# EAGLE design main (EAGLE 6.5.0)
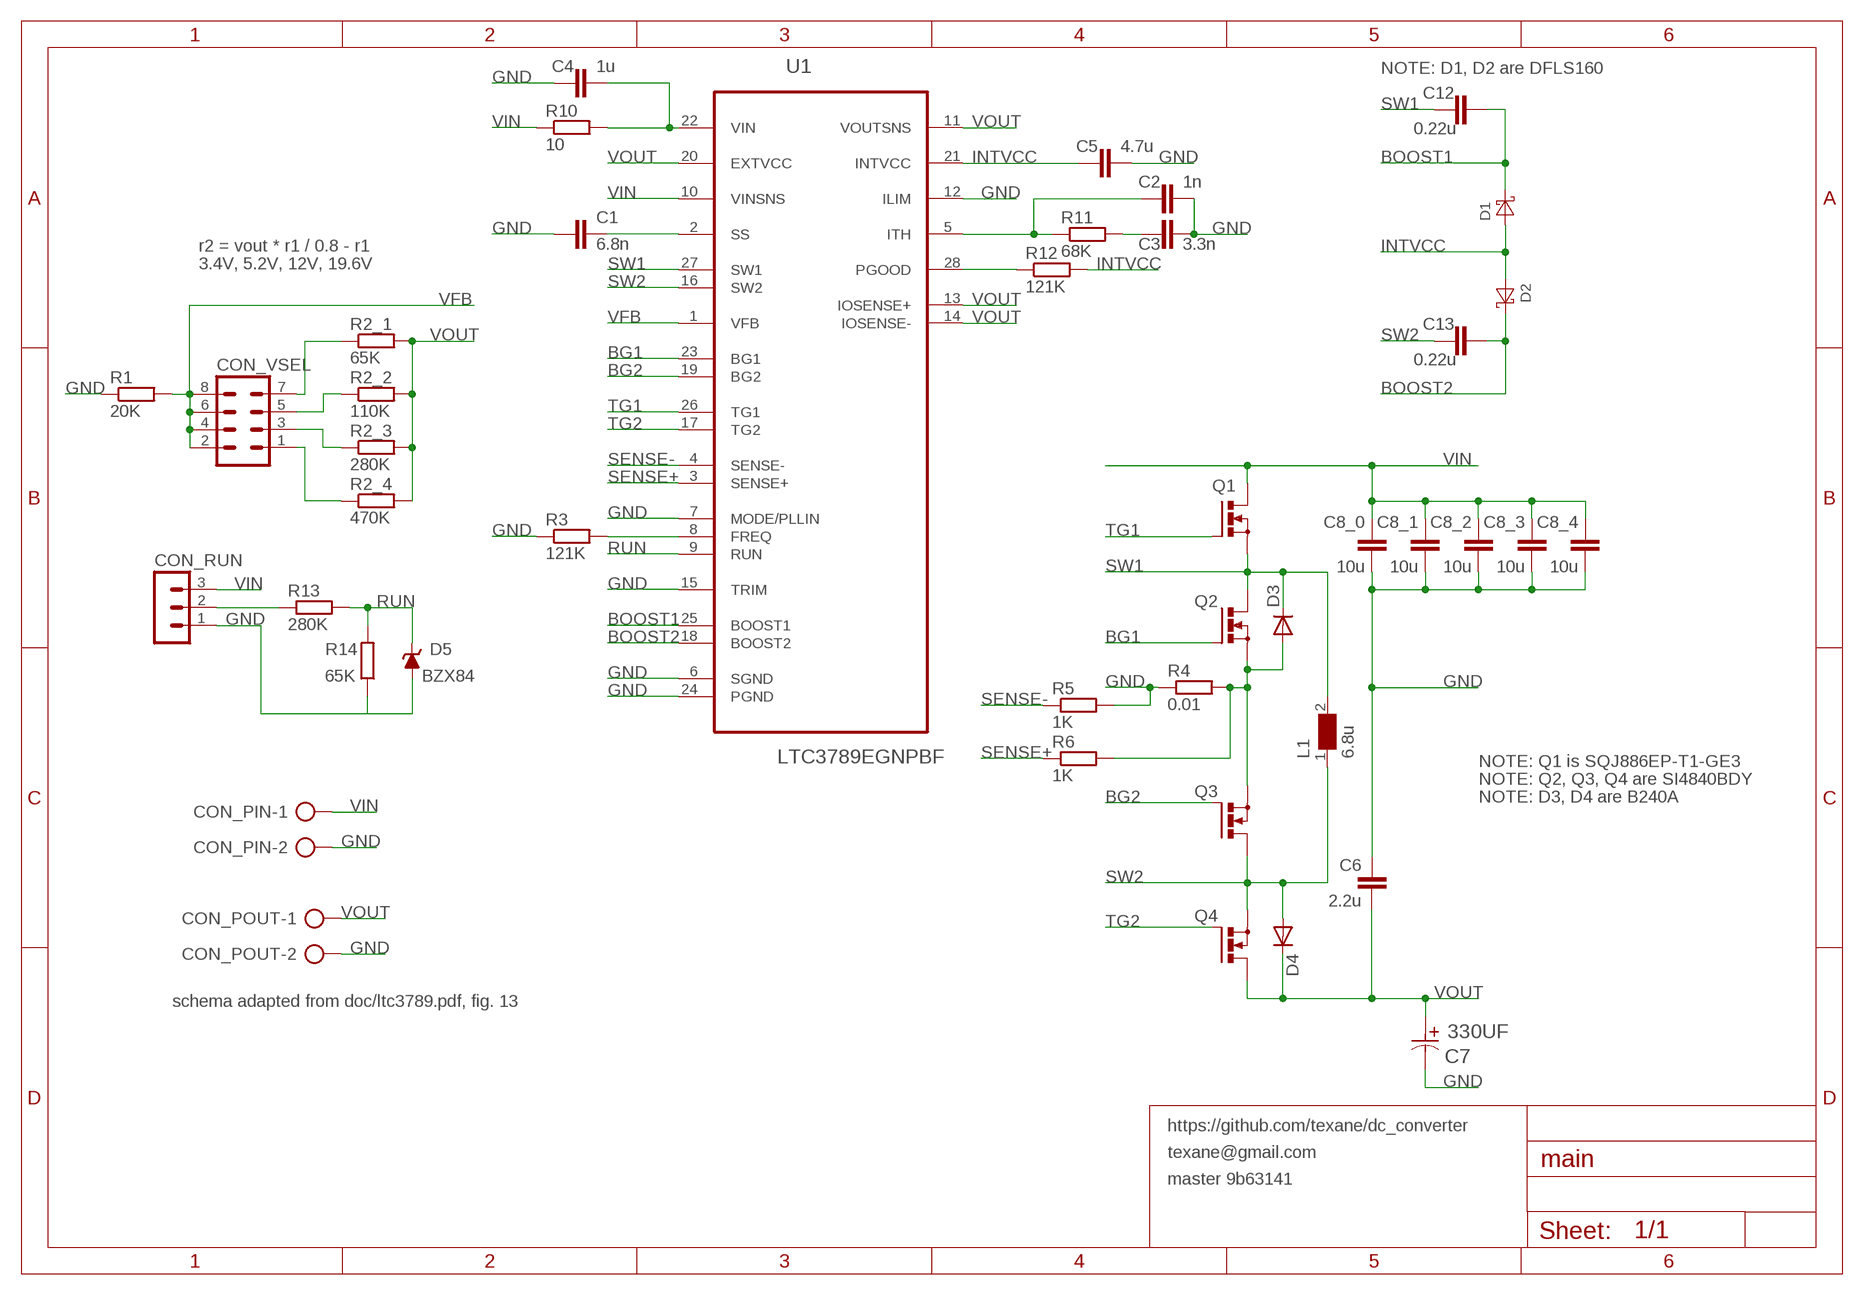
[diagram p0: schematic, sheet 1]

## Parts
C1  6.8n  C-EUC1206K  [C1206K]
C2  1n  C-EUC1206K  [C1206K]
C3  3.3n  C-EUC1206K  [C1206K]
C4  1u  C-EUC1206K  [C1206K]
C5  4.7u  C-EUC1206K  [C1206K]
C6  2.2u  C-EUC1206K  [C1206K]
C7  330UF  EEE-FT1H331AP-CASE-G  [CAPAE1030X1050N]
C8_0  10u  C-EUC1206K  [C1206K]
C8_1  10u  C-EUC1206K  [C1206K]
C8_2  10u  C-EUC1206K  [C1206K]
C8_3  10u  C-EUC1206K  [C1206K]
C8_4  10u  C-EUC1206K  [C1206K]
C12  0.22u  C-EUC1206K  [C1206K]
C13  0.22u  C-EUC1206K  [C1206K]
CON_PIN  AK300/2  [AK300/2]
CON_POUT  AK300/2  [AK300/2]
CON_RUN  MA03-1  [MA03-1]
CON_VSEL  MA04-2  [MA04-2]
D1  DIODE-SCHOTTKY-POWER-DI-123  [POWER-DI-123]
D2  DIODE-SCHOTTKY-POWER-DI-123  [POWER-DI-123]
D3  DIODE-DO214AC  [DO214AC]
D4  DIODE-DO214AC  [DO214AC]
D5  BZX84  [SOT23]
L1  6.8u  WE-HCC-7443320680_1210  [WE-HCC_1210]
Q1  SQJ886EP  [POWERPAK-SO-08L]
Q2  N-MOSFET-SO8S  [SO-08]
Q3  N-MOSFET-SO8S  [SO-08]
Q4  N-MOSFET-SO8S  [SO-08]
R1  20K  R-EU_R1206  [R1206]
R2_1  65K  R-EU_R1206  [R1206]
R2_2  110K  R-EU_R1206  [R1206]
R2_3  280K  R-EU_R1206  [R1206]
R2_4  470K  R-EU_R1206  [R1206]
R3  121K  R-EU_R1206  [R1206]
R4  0.01  R-EU_R1206  [R1206]
R5  1K  R-EU_R1206  [R1206]
R6  1K  R-EU_R1206  [R1206]
R10  10  R-EU_R1206  [R1206]
R11  68K  R-EU_R1206  [R1206]
R12  121K  R-EU_R1206  [R1206]
R13  280K  R-EU_R1206  [R1206]
R14  65K  R-EU_R1206  [R1206]
U1  LTC3789EGNPBF  [SOP65P640X120-28N]

## Nets
BG1: Q2.4(G) U1.23(BG1)
BG2: Q3.4(G) U1.19(BG2)
BOOST1: C12.2 D1.C U1.25(BOOST1)
BOOST2: C13.2 D2.C U1.18(BOOST2)
GND: C1.1 C2.2 C3.2 C4.1 C5.2 C6.2 C7.2 C8_0.2 C8_1.2 C8_2.2 C8_3.2 C8_4.2 CON_PIN.2 CON_POUT.2 CON_RUN.1 D5.1(A) R1.1 R3.1 R4.1 R5.2 R14.1 U1.6(SGND) U1.7(MODE/PLLIN) U1.12(ILIM) U1.15(TRIM) U1.24(PGND)
INTVCC: C5.1 D1.A D2.A R12.2 U1.21(INTVCC)
N$1: R3.2 U1.8(FREQ)
N$2: C4.2 R10.2 U1.22(VIN)
N$3: C1.2 U1.2(SS)
N$4: C2.1 R11.1 U1.5(ITH)
N$5: C3.1 R11.2
N$6: R12.1 U1.28(PGOOD)
N$7: CON_VSEL.5 R2_2.1
N$8: CON_VSEL.7 R2_1.1
N$9: D3.A Q2.1(S) Q2.2(S) Q2.3(S) Q3.1(S) Q3.2(S) Q3.3(S) R4.2 R6.2
N$10: CON_VSEL.3 R2_3.1
N$11: CON_RUN.2 R13.1
RUN: D5.3(C) R13.2 R14.2 U1.9(RUN)
SENSE+: R6.1 U1.3(SENSE+)
SENSE-: R5.1 U1.4(SENSE-)
SW1: C12.1 D3.C L1.2 Q1.1(S) Q1.2(S) Q1.3(S) Q2.5(D) Q2.6(D) Q2.7(D) Q2.8(D) U1.27(SW1)
SW2: C13.1 D4.A L1.1 Q3.5(D) Q3.6(D) Q3.7(D) Q3.8(D) Q4.1(S) Q4.2(S) Q4.3(S) U1.16(SW2)
TG1: Q1.4(G) U1.26(TG1)
TG2: Q4.4(G) U1.17(TG2)
VFB: CON_VSEL.1 CON_VSEL.2 CON_VSEL.4 CON_VSEL.6 CON_VSEL.8 R1.2 R2_4.1 U1.1(VFB)
VIN: C8_0.1 C8_1.1 C8_2.1 C8_3.1 C8_4.1 CON_PIN.1 CON_RUN.3 Q1.5-8(D) R10.1 U1.10(VINSNS)
VOUT: C6.1 C7.1 CON_POUT.1 D4.C Q4.5(D) Q4.6(D) Q4.7(D) Q4.8(D) R2_1.2 R2_2.2 R2_3.2 R2_4.2 U1.11(VOUTSNS) U1.13(IOSENSE+) U1.14(IOSENSE-) U1.20(EXTVCC)

## Notes on the sheet
- NOTE: D1, D2 are DFLS160
- r2 = vout * r1 / 0.8 - r1
- 3.4V, 5.2V, 12V, 19.6V
- NOTE: Q1 is SQJ886EP-T1-GE3
- NOTE: Q2, Q3, Q4 are SI4840BDY
- NOTE: D3, D4 are B240A
- schema adapted from doc/ltc3789.pdf, fig. 13
- https://github.com/texane/dc_converter
- texane@gmail.com
- master 9b63141

## Library data of the parts
C1-C6 C8_0 C8_1-C8_4 C12 C13 = rcl:C-EU: CAPACITOR, European symbol
C7 = Panasonic-EEEFT_EEEH:EEE-: Aluminum Electrolytic Capacitors,Surface Mount Type; MPN: EEE-FT1H331AP; OC_FARNELL: 1868428; OC_NEWARK: 31T8184; PACKAGE: CASE-G; SUPPLIER: PANASONIC; TOLERANCE: ±20 %; VOLTAGERATING: 50V
CON_PIN CON_POUT = con-ptr500:AK300/2: CONNECTOR; OC_FARNELL: unknown; OC_NEWARK: unknown
CON_RUN = con-lstb:MA03-1: PIN HEADER; OC_FARNELL: unknown; OC_NEWARK: unknown
CON_VSEL = con-lstb:MA04-2: PIN HEADER; OC_FARNELL: unknown; OC_NEWARK: unknown
D1 D2 = diode:DIODE-SCHOTTKY-: SCHOTTKY DIODE
D3 D4 = diode:DIODE-: DIODE
D5 = diode:BZX84: Z DIODE
L1 = WE-HCC:WE-HCC: SMD High Current Cube Inductor WE-HCC - magnetically shieled - current capability up to 27A - excellent saturation characteristics -- filter choke for DC/DC converter -- single and polyphase buck converter -- filter choke for motor electronics; MPN: 7443320680; OC_FARNELL: 1848236; OC_NEWARK: 13T9756; PACKAGE: 1210; SUPPLIER: Wuerth Elektronik
Q1 = transistor-fet:SQJ886EP: N-Channel MOSFET - 60v
Q2-Q4 = transistor-power:N-MOSFET-SO8: N-Channel MOSFET Example: FDS7760A; N-Channel Logic Level PowerTrench® MOSFET FDS2572; N-Channel UltraFET® Trench MOSFET Source: www.fairchildsemi.com
R1 R2_1-R2_4 R3-R6 R10-R14 = resistor:R-EU_: RESISTOR, European symbol
U1 = LTC-LTC3789EGN#PBF:LTC3789EGNPBF: High Efficiency, Synchronous, 4-Switch Buck-Boost Controller; MPN: LTC3789EGN#PBF; OC_FARNELL: 2102662; OC_NEWARK: 24T0452; PACKAGE: TSSOP-28; SUPPLIER: LINEAR TECHNOLOGY

## Board
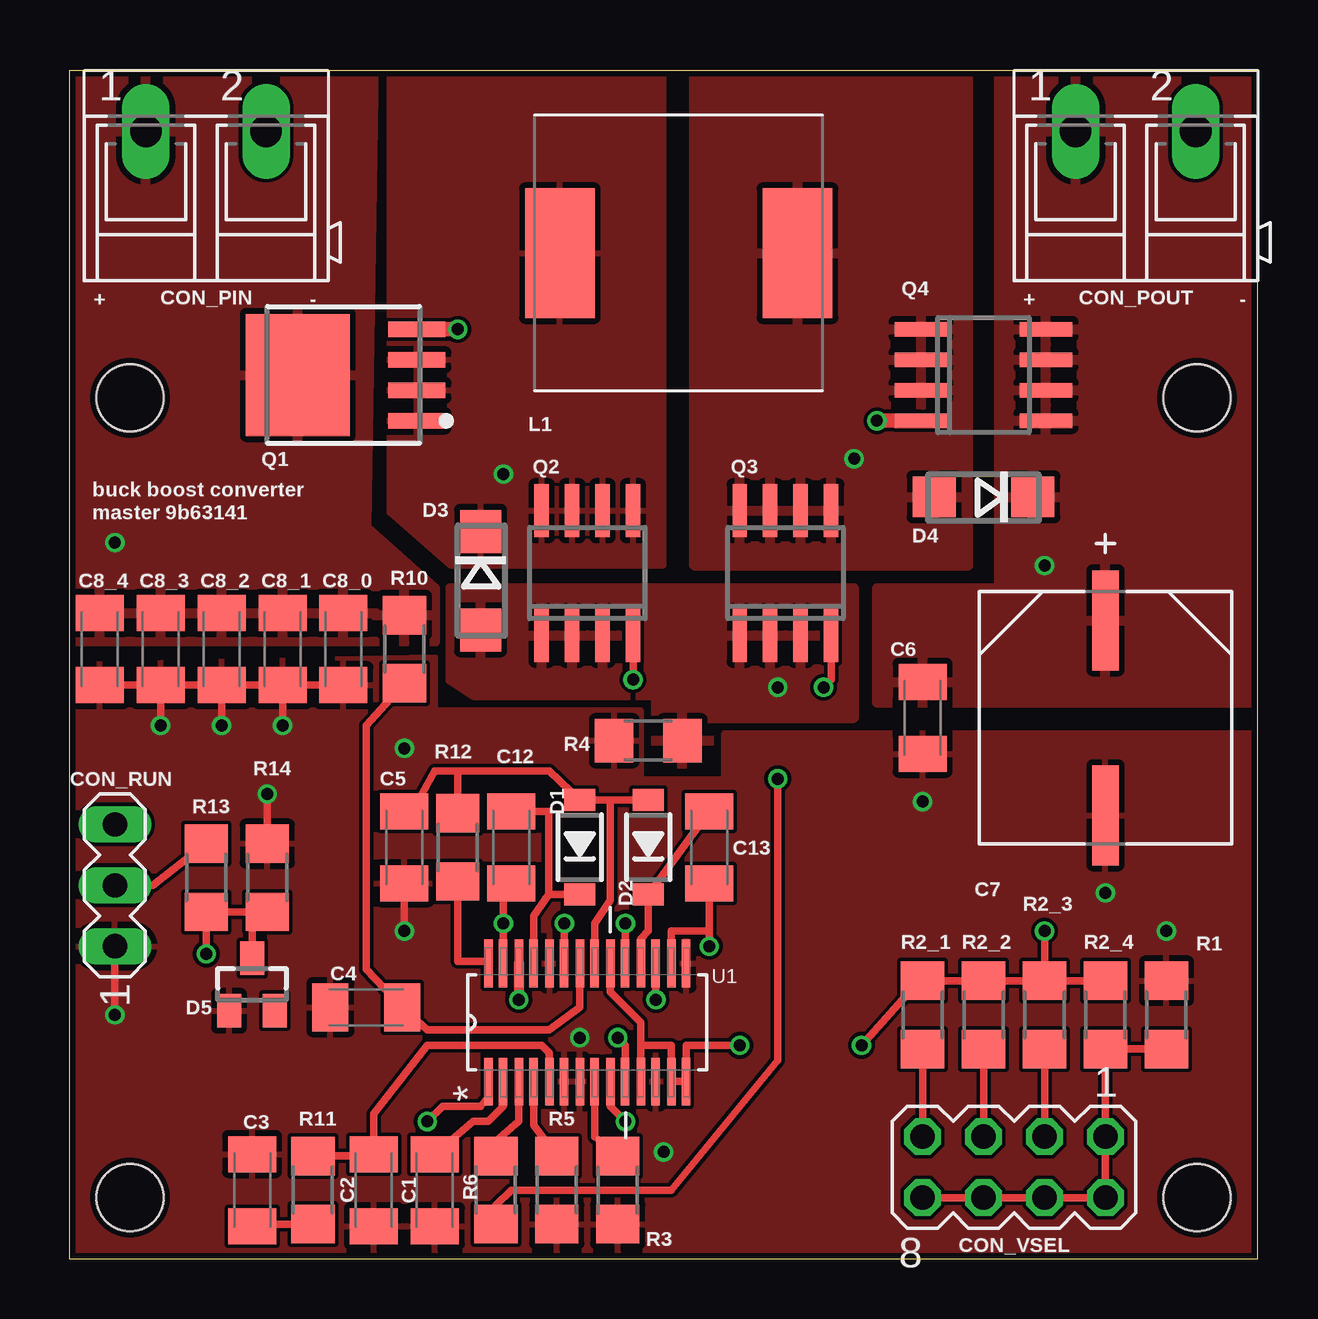
[diagram p1: board, top side]
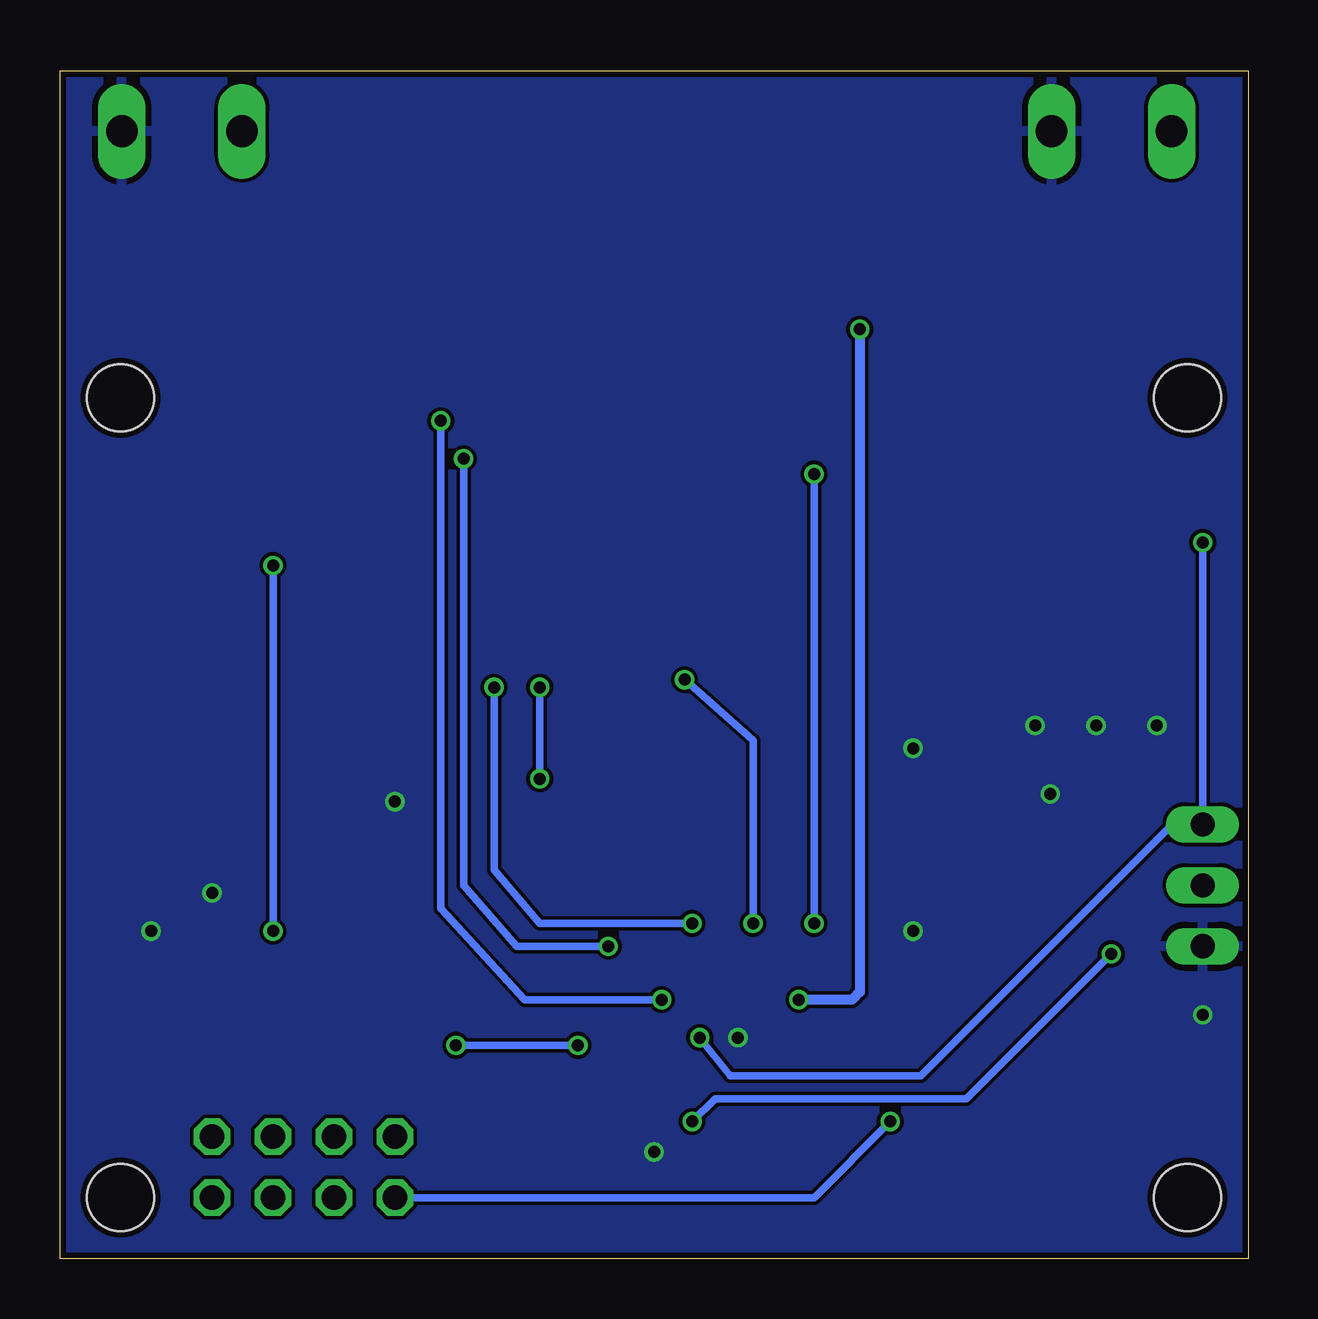
[diagram p2: board, bottom side, seen from below]

Size 49.52 x 49.52 mm. Coordinates in mm from the lower left corner, seen from the top.
Outline: 0,0 49.52,0 49.52,49.52 0,49.52 0,0
Copper layers (1*16): Top 0.035mm / dielectric 1.5mm / Bottom 0.035mm
Design rules "SeeedStudio_2layer_DRU_no_angle_20140221": minimum track width 6mil, minimum drill 12mil, track to track 6mil, track to pad 6mil, pad to pad 6mil, via to via 6mil, smd to smd 0mil, copper to edge 10mil, drill to drill 10mil, minimum pad ring 10mil, minimum via ring 6mil, stop-mask expansion 2mil, vias tented up to drill 100mil, thermal gap 10mil
Holes 2.8 mm at 2.54,35.88 46.99,35.88 46.99,2.54 2.54,2.54

### Footprints (pad centres in the part's own frame; a part is rotated, then mirrored left to right if it is on the bottom)
C1206K = smd 1.5 x 2: 1 -1.5,0; 2 1.5,0
CAPAE1030X1050N = smd 4.166 x 1.092: 1 -4.064,0; 2 4.064,0
AK300/2 = drill 1.321 long: 1 -2.515,0; 2 2.489,0
MA03-1 = drill 1.016 long: 1 -2.54,0; 2 0,0; 3 2.54,0
MA04-2 = drill 1.016 octagon: 1 -3.81,-1.27; 2 -3.81,1.27; 3 -1.27,-1.27; 4 -1.27,1.27; 5 1.27,-1.27; 6 1.27,1.27; 7 3.81,-1.27; 8 3.81,1.27
POWER-DI-123 = smd 0.92 x 1.3: A 1.97,0; C -1.97,0
DO214AC = smd 1.8 x 1.7: A 2.05,0; C -2.05,0
SOT23 = smd 1 x 1.4: 1 -0.95,-1.1; 2 0.95,-1.1; 3 0,1.1
WE-HCC_1210 = smd 2.9 x 5.4: 1 -4.95,0; 2 4.95,0
POWERPAK-SO-08L = smd 0.635 x 2.378: 1 -1.905,-3.058; 2 -0.635,-3.058; 3 0.635,-3.058; 4 1.905,-3.058 | smd 5.08 x 4.318: 5-8 0,1.905
SO-08 = smd 0.6 x 2.2: 1 -1.905,-2.6; 2 -0.635,-2.6; 3 0.635,-2.6; 4 1.905,-2.6; 5 1.905,2.6; 6 0.635,2.6; 7 -0.635,2.6; 8 -1.905,2.6
R1206 = smd 1.6 x 1.803: 1 -1.422,0; 2 1.422,0
SOP65P640X120-28N = smd 1.981 x 0.356: 1 -2.464,4.115; 2 -2.464,3.505; 3 -2.464,2.845; 4 -2.464,2.235; 5 -2.464,1.575; 6 -2.464,0.965; 7 -2.464,0.305; 8 -2.464,-0.305; 9 -2.464,-0.965; 10 -2.464,-1.575; 11 -2.464,-2.235; 12 -2.464,-2.845; 13 -2.464,-3.505; 14 -2.464,-4.115; 15 2.464,-4.115; 16 2.464,-3.505; 17 2.464,-2.845; 18 2.464,-2.235; 19 2.464,-1.575; 20 2.464,-0.965; 21 2.464,-0.305; 22 2.464,0.305; 23 2.464,0.965; 24 2.464,1.575; 25 2.464,2.235; 26 2.464,2.845; 27 2.464,3.505; 28 2.464,4.115

### Placement (x,y rotation side)
C1  15.24,2.86 90 top
C2  12.7,2.86 270 top
C3  7.62,2.86 90 top
C4  12.38,10.48 0 top
C5  13.97,17.14 270 top
C6  35.56,22.54 270 top
C7  43.18,22.54 270 top
C8_0  11.43,25.4 270 top
C8_1  8.89,25.4 270 top
C8_2  6.35,25.4 270 top
C8_3  3.81,25.4 270 top
C8_4  1.27,25.4 270 top
C12  18.41,17.14 90 top
C13  26.67,17.14 90 top
CON_PIN  5.71,46.99 0 top
CON_POUT  44.45,46.99 0 top
CON_RUN  1.91,15.56 90 top
CON_VSEL  39.37,3.81 180 top
D1  21.27,17.14 90 top
D2  24.13,17.14 90 top
D3  17.14,28.26 270 top
D4  38.1,31.75 180 top
D5  7.62,11.43 0 top
L1  25.4,41.91 180 top
Q1  11.43,36.83 90 top
Q2  21.59,28.57 0 top
Q3  29.84,28.57 0 top
Q4  38.1,36.83 270 top
R1  45.72,10.16 270 top
R2_1  35.56,10.16 90 top
R2_2  38.1,10.16 90 top
R2_3  40.64,10.16 90 top
R2_4  43.18,10.16 90 top
R3  22.86,2.86 90 top
R4  24.13,21.59 0 top
R5  20.32,2.86 270 top
R6  17.78,2.86 270 top
R10  13.97,25.4 270 top
R11  10.16,2.86 270 top
R12  16.19,17.14 90 top
R13  5.71,15.88 270 top
R14  8.26,15.88 270 top
U1  21.59,9.84 90 top

### Tracks (layer width: path | path; a pad name or v marks a point on that pad's centre or on a via)
BG1  (via drill 0.5)
  Top 0.305: U1.23 20.64,12.31 v20.64,13.97 | v23.5,24.13 Q2.4
  Bottom 0.305: v20.64,13.97 20.64,21.59 v23.5,24.13
BG2  (via drill 0.5)
  Top 0.305: U1.19 23.18,12.31 v23.18,13.97 | v31.43,23.81 31.75,24.13 Q3.4
  Bottom 0.305: v23.18,13.97 29.53,13.97 31.43,16.19 v31.43,23.81
BOOST1
  Top 0.305: D1.C 19.99,15.18 | 19.99,15.18 19.37,14.29 19.37,12.31 U1.25 | C12.2 19.99,18.64 19.99,15.18
BOOST2
  Top 0.305: U1.18 23.81,12.31 23.81,13.34 24.13,13.65 24.13,15.15 | C13.2 24.13,15.15 | 24.13,15.15 D2.C
GND  (via drill 0.5)
  Top 0.305: C8_1.2 v8.89,22.23 | C8_2.2 v6.35,22.23 | C8_3.2 C8_2.2 | C8_2.2 C8_1.2 | C8_1.2 C8_0.2 | v3.81,22.23 C8_3.2 | C8_3.2 C8_4.2 | CON_RUN.1 v1.91,10.16 | R14.1 v8.26,19.37 | C5.2 v13.97,13.65
  other vias: 21.27,9.21 24.77,4.45 35.56,19.05 45.72,13.65 43.18,15.24 13.97,21.27
  pour Top: -0.95,0 -0.32,24.77 15.24,25.08 15.24,22.86 23.81,22.86 23.81,20 27.3,20 27.3,21.91 49.53,21.91 49.53,0
  pour Bottom: -0.64,50.48 50.16,50.48 49.85,0 -0.32,0
INTVCC
  Top 0.305: 22.54,19.11 D1.A 20,20.32 16.19,20.32 | 22.54,19.11 D2.A | R12.2 16.19,20.32 | U1.21 21.91,12.31 21.91,13.97 22.54,14.92 22.54,19.11 | C5.1 14.29,18.64 15.24,20.32 16.19,20.32
N$1
  Top 0.305: R3.2 21.91,5.08 21.91,6.5 21.89,6.5 U1.8
N$2
  Top 0.305: R10.2 12.38,22.23 12.38,12.06 C4.2 14.92,9.53 20,9.53 21.27,10.48 U1.22
N$3
  Top 0.305: C1.2 16.83,5.71 17.46,5.71 18.1,6.35 U1.2
N$4
  Top 0.305: R11.1 12.7,4.28 C2.1 12.7,6.03 14.92,8.89 19.68,8.89 20,8.57 20,7.38 U1.5
N$5
  Top 0.305: R11.2 7.62,1.44 C3.1
N$6
  Top 0.305: R12.1 16.19,12.38 17.48,12.38 U1.28
N$7
  Top 0.305: CON_VSEL.5 R2_2.1
N$8
  Top 0.305: CON_VSEL.7 R2_1.1
N$9  (via drill 0.5)
  Top 0.305: R6.2 17.78,2.22 18.41,2.86 25.08,2.86 29.53,8.26 v29.53,20
  Bottom 0.305: v29.53,20 v29.53,23.81
  pour Top: 16.83,23.5 24.45,23.5 24.45,20.64 26.67,20.64 26.67,22.54 32.7,22.54 32.7,27.94 15.88,27.94 15.88,24.13
N$10
  Top 0.305: CON_VSEL.3 R2_3.1
N$11
  Top 0.305: CON_RUN.2 3.49,15.56 R13.1
RUN  (via drill 0.5)
  Top 0.305: 7.62,14.45 R13.2 v5.71,12.7 | 7.62,14.45 R14.2 | U1.9 22.55,6.68 22.54,6.35 v23.18,5.71 | D5.3 7.62,14.45
  Bottom 0.305: v23.18,5.71 22.23,6.67 11.75,6.67 v5.71,12.7
SENSE+
  Top 0.305: R6.1 17.79,4.92 18.73,5.71 18.73,7.38 U1.3
SENSE-
  Top 0.305: R5.1 19.36,5.55 U1.4
SW1  (via drill 0.5)
  Top 0.305: U1.27 18.1,12.31 v18.1,13.97 18.1,15.64 C12.1
  Bottom 0.305: v18.1,13.97 v18.1,32.7
  pour Top: 13.34,31.11 15.88,28.89 24.77,28.89 24.77,49.85 13.34,49.85
SW2  (via drill 0.5)
  Top 0.305: U1.16 25.08,12.31 25.08,13.65 26.67,13.65 | C13.1 26.67,13.65 | v26.67,13.02 26.67,13.65
  Bottom 0.305: v26.67,13.02 30.48,13.02 32.7,15.56 v32.7,33.34
  pour Top: 26.04,49.85 26.04,28.89 37.47,28.89 37.47,49.85
TG1  (via drill 0.5)
  Top 0.305: v18.73,10.79 18.75,10.79
  Top 0.406: 18.75,10.79 U1.26
  Top 0.61: Q1.4 v16.19,38.73
  Bottom 0.406: v16.19,38.73 16.19,11.11 16.51,10.79 v18.73,10.79
TG2  (via drill 0.5)
  Top 0.305: v24.45,10.79 24.43,10.79 U1.17
  Top 0.61: Q4.4 v33.66,34.92
  Bottom 0.305: v33.66,34.92 33.66,14.61 30.16,10.79 v24.45,10.79
VFB  (via drill 0.5)
  Top 0.305: CON_VSEL.8 CON_VSEL.6 CON_VSEL.4 CON_VSEL.2 CON_VSEL.1 R2_4.1 R1.2 | U1.1 17.46,6.74 17.14,6.35 15.56,6.35 v14.92,5.71
  Bottom 0.305: v14.92,5.71 18.1,2.54 CON_VSEL.8
VIN  (via drill 0.5)
  Top 0.305: U1.10 23.18,7.38 23.18,8.89 v22.86,9.21
  Bottom 0.305: v1.91,29.84 CON_RUN.3 3.17,18.1 13.65,7.62 21.59,7.62 v22.86,9.21
  pour Top: 12.7,49.85 12.38,30.48 15.24,27.94 15.24,25.72 0,25.72 0.32,50.16
VOUT  (via drill 0.5)
  Top 0.305: R2_1.2 R2_2.2 R2_3.2 | R2_3.2 R2_4.2 | R2_1.2 R2_3.2 | R2_3.2 v40.64,13.65 | v27.94,8.89 25.72,8.89 25.72,7.38 U1.14 U1.13 25.08,7.38 25.08,8.89 23.82,8.89 | v33.02,8.89 35.56,11.75 R2_1.2 | 23.82,8.89 U1.11 | U1.20 22.54,12.31 22.54,11.11 23.5,10.16 23.82,9.84 23.82,8.89
  Bottom 0.305: v40.64,13.65 v40.64,28.89 | v27.94,8.89 v33.02,8.89
  pour Top: 38.73,49.85 38.73,27.94 33.66,27.94 33.66,23.18 49.53,23.18 49.53,49.85

### Text on the board
tNames: + | - | + | - | buck boost converter | master 9b63141